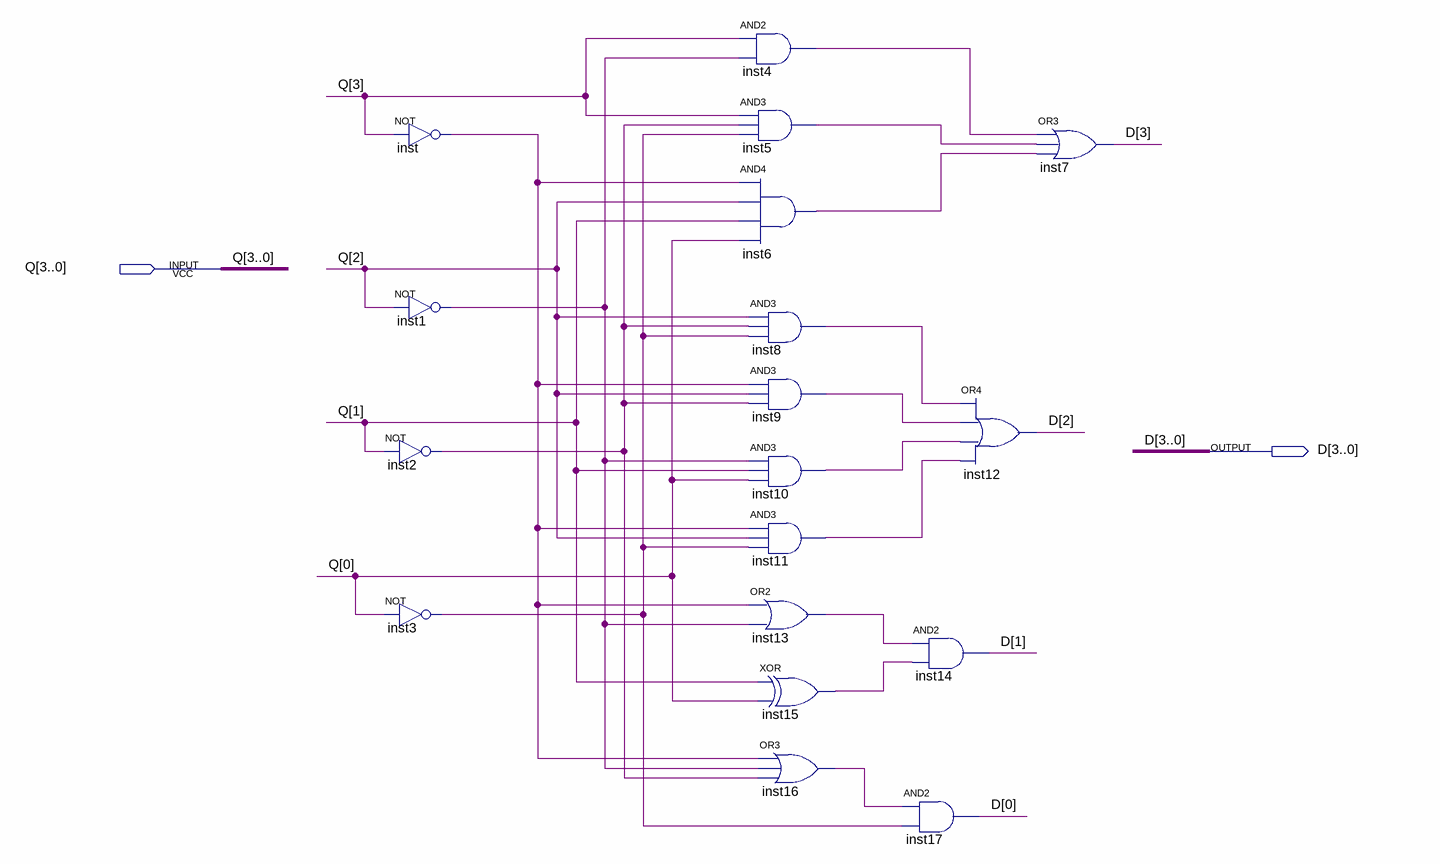
[diagram p0: schematic sheet]
// Quartus schematic Next_State.bdf as structural Verilog: 18 symbols, 2 pins
module Next_State (
  input  [3:0] Q,
  output [3:0] D
);

  wire inst1_out, inst2_out, inst3_out, inst4_out, inst5_out, inst6_out, inst8_out, inst9_out, inst10_out,
       inst11_out, inst13_out, inst15_out, inst16_out, inst_out;

  not inst (inst_out, Q[3]);
  not inst1 (inst1_out, Q[2]);
  not inst2 (inst2_out, Q[1]);
  not inst3 (inst3_out, Q[0]);
  and inst4 (inst4_out, Q[3], inst1_out);
  and inst5 (inst5_out, Q[3], inst2_out, inst3_out);
  and inst6 (inst6_out, inst_out, Q[2], Q[1], Q[0]);
  and inst8 (inst8_out, Q[2], inst2_out, inst3_out);
  and inst9 (inst9_out, inst_out, Q[2], inst2_out);
  and inst10 (inst10_out, inst1_out, Q[1], Q[0]);
  and inst11 (inst11_out, inst_out, Q[2], inst3_out);
  or inst13 (inst13_out, inst_out, inst1_out);
  xor inst15 (inst15_out, Q[1], Q[0]);
  or inst16 (inst16_out, inst_out, inst1_out, inst2_out);
  and inst17 (D[0], inst16_out, inst3_out);
  or inst12 (D[2], inst8_out, inst9_out, inst10_out, inst11_out);
  and inst14 (D[1], inst13_out, inst15_out);
  or inst7 (D[3], inst4_out, inst5_out, inst6_out);
endmodule
